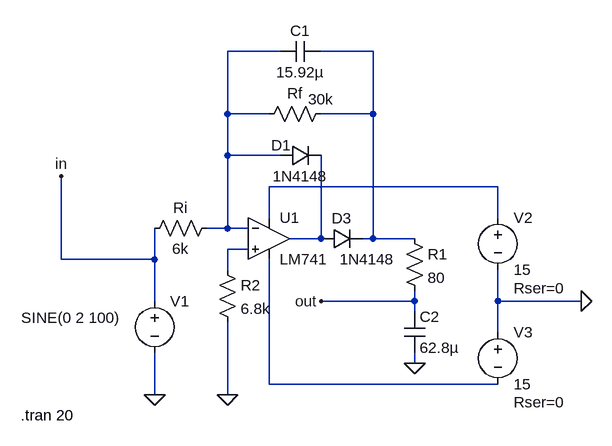
[diagram p0: schematic LM741ACDconverter.asc]
LM741ACDconverter.asc, the LTspice schematic file:
Version 4
SHEET 1 880 680
WIRE 208 -144 128 -144
WIRE 352 -144 272 -144
WIRE 128 -48 128 -144
WIRE 192 -48 128 -48
WIRE 352 -48 352 -144
WIRE 352 -48 272 -48
WIRE 128 16 128 -48
WIRE 208 16 128 16
WIRE 544 64 192 64
WIRE 192 112 192 64
WIRE 544 112 544 64
WIRE 128 128 128 16
WIRE 128 128 96 128
WIRE 160 128 128 128
WIRE 272 144 272 16
WIRE 272 144 224 144
WIRE 352 144 352 -48
WIRE 352 144 336 144
WIRE 416 144 352 144
WIRE 160 160 128 160
WIRE -128 176 -128 48
WIRE 16 176 16 128
WIRE 16 176 -128 176
WIRE 128 192 128 160
WIRE 16 240 16 176
WIRE 416 240 416 224
WIRE 416 240 272 240
WIRE 544 240 544 192
WIRE 672 240 544 240
WIRE 416 256 416 240
WIRE 544 288 544 240
WIRE 416 336 416 320
WIRE 192 368 192 176
WIRE 544 368 192 368
WIRE 16 384 16 320
WIRE 128 384 128 272
FLAG 16 384 0
FLAG -128 48 in
FLAG 272 240 out
FLAG 672 240 0
FLAG 128 384 0
FLAG 416 336 0
SYMBOL LM741 192 80 R0
SYMATTR InstName U1
SYMBOL voltage 544 96 R0
WINDOW 123 0 0 Left 0
WINDOW 39 24 124 Left 2
SYMATTR SpiceLine Rser=0
SYMATTR InstName V2
SYMATTR Value 15
SYMBOL voltage 544 272 R0
WINDOW 123 0 0 Left 0
WINDOW 39 24 124 Left 2
SYMATTR SpiceLine Rser=0
SYMATTR InstName V3
SYMATTR Value 15
SYMBOL res 112 112 R90
WINDOW 0 0 56 VBottom 2
WINDOW 3 32 56 VTop 2
SYMATTR InstName Ri
SYMATTR Value 6k
SYMBOL res 112 176 R0
SYMATTR InstName R2
SYMATTR Value 6.8k
SYMBOL diode 208 32 R270
WINDOW 0 16 3 VTop 2
WINDOW 3 0 32 VBottom 2
SYMATTR InstName D1
SYMATTR Value 1N4148
SYMBOL diode 272 160 R270
WINDOW 0 32 32 VTop 2
WINDOW 3 0 71 VBottom 2
SYMATTR InstName D3
SYMATTR Value 1N4148
SYMBOL res 288 -64 R90
WINDOW 0 0 56 VBottom 2
WINDOW 3 -22 16 VTop 2
SYMATTR InstName Rf
SYMATTR Value 30k
SYMBOL cap 272 -160 R90
WINDOW 0 0 32 VBottom 2
WINDOW 3 32 32 VTop 2
SYMATTR InstName C1
SYMATTR Value 15.92µ
SYMBOL voltage 16 224 R0
WINDOW 3 -205 42 Left 2
WINDOW 123 24 124 Left 2
WINDOW 39 0 0 Left 0
SYMATTR Value SINE(0 2 100)
SYMATTR InstName V1
SYMBOL res 400 128 R0
SYMATTR InstName R1
SYMATTR Value 80
SYMBOL cap 400 256 R0
SYMATTR InstName C2
SYMATTR Value 62.8µ
TEXT -190 416 Left 2 !.tran 20

The netlist it stands for:
* LM741ACDconverter.asc
XU1 N005 N001 N003 N006 N004 LM741  ; pins In+ In- V+ V- OUT
V2 N003 0 15 Rser=0
V3 0 N006 15 Rser=0
Ri N001 in 6k
R2 N005 0 6.8k
D1 N001 N004 1N4148
D3 N004 N002 1N4148
Rf N002 N001 30k
C1 N002 N001 15.92µ
V1 in 0 SINE(0 2 100)
R1 N002 out 80
C2 out 0 62.8µ
.model D D
.lib standard.dio
.tran 20
.lib LM741.lib
.backanno
.end